# EasyEDA Pro project Solkatstice_v1.1_2025-04-18.epro, board Solkatstice
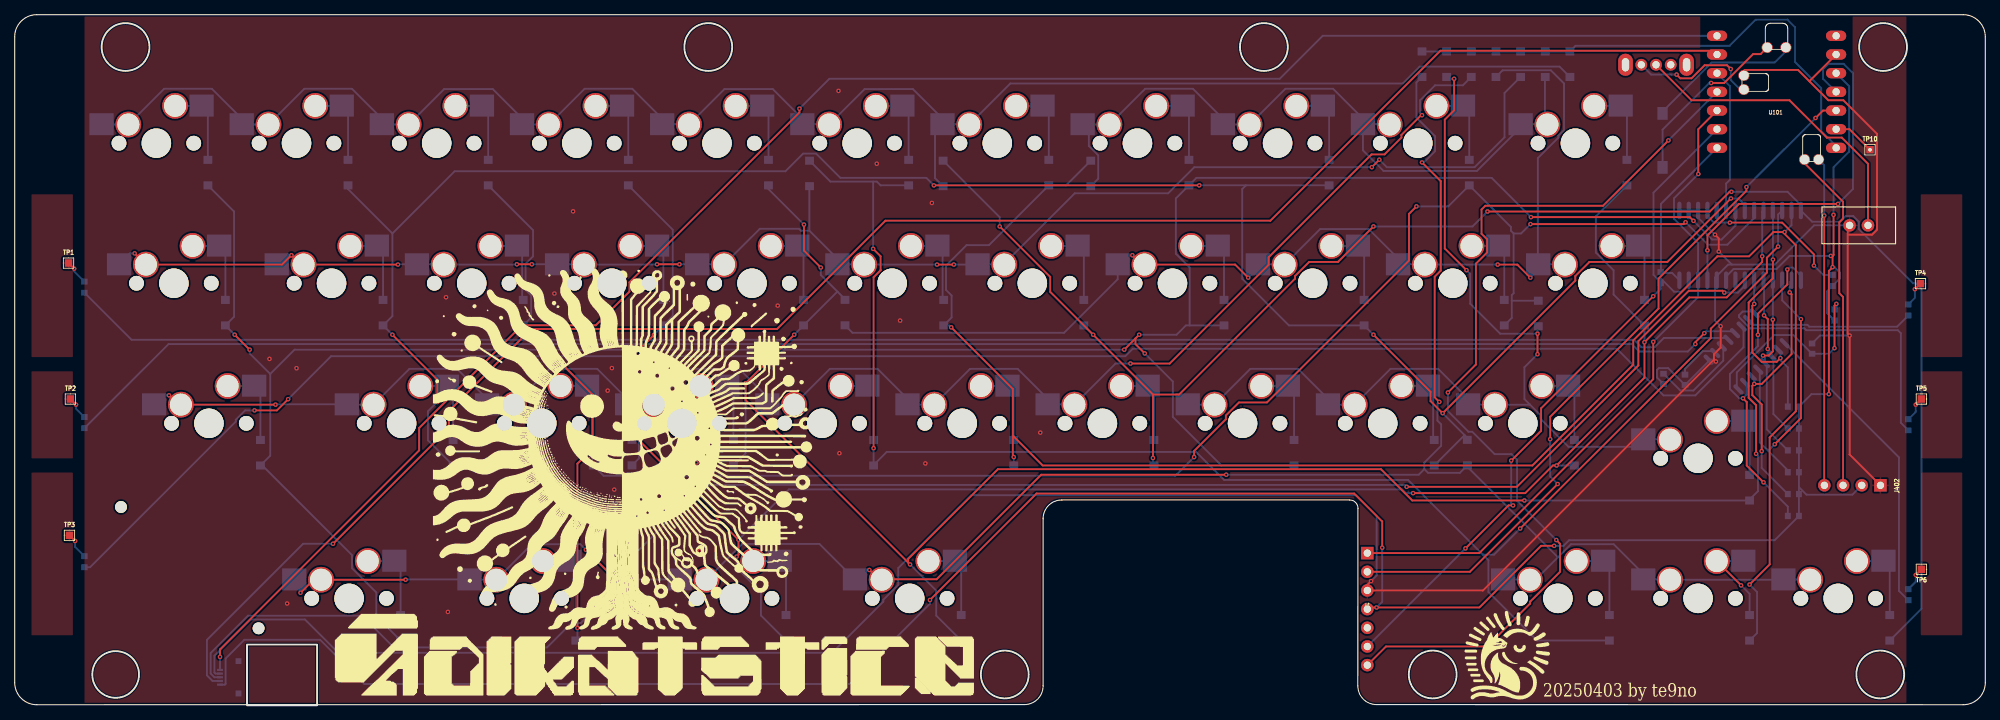
[diagram p2: board, top side]
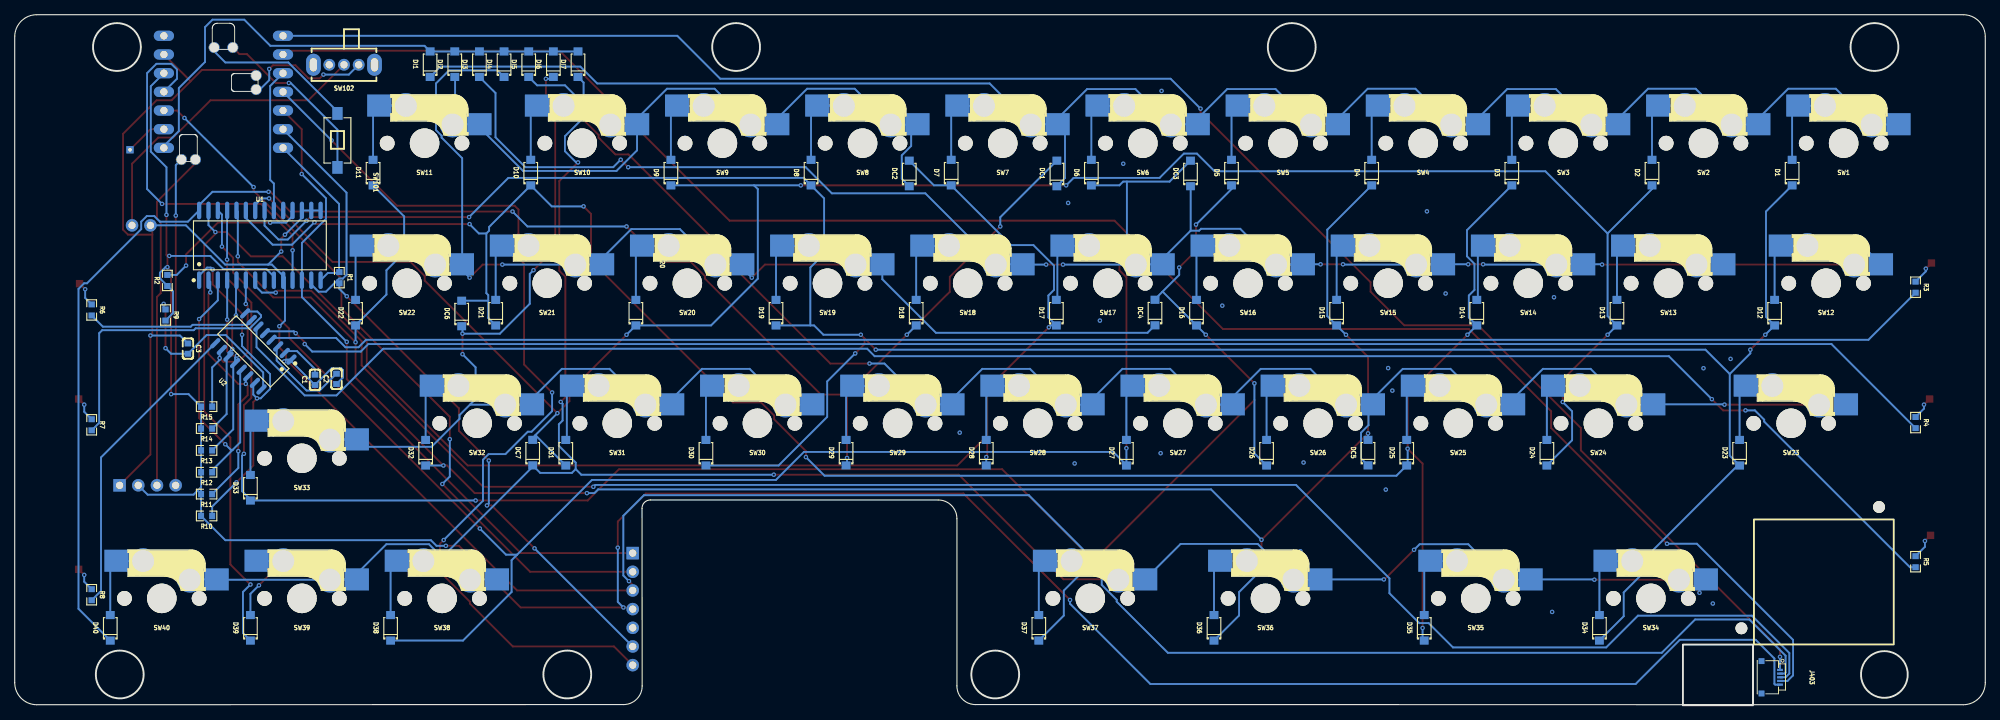
[diagram p3: board, bottom side, seen from below]

Outline 267.84 x 93.93 mm; copper layers: Top Layer, Bottom Layer. Coordinates in mm from the lower left corner of the outline.
Outline path: circle c13.72,4.19 r3.17 ; circle c15.06,89.53 r3.25 ; rectangle 31.57,8.25 41.1,0 ; circle c94.27,89.53 r3.25 ; circle c134.57,4.19 r3.25 ; circle c169.79,89.53 r3.25 ; circle c192.74,4.19 r3.25 ; circle c253.57,4.19 r3.25 ; circle c253.95,89.53 r3.25 ; 0,90.93 arc(0.88,93.05) 3,93.93 264.84,93.93 arc(266.96,93.05) 267.84,90.93 267.84,3.08 arc(266.96,0.96) 264.84,0.08 185.1,0.1 arc(183.3,0.84) 182.56,2.64 182.58,26.77 arc(182.26,27.58) 181.46,27.93 142.32,27.93 arc(140.52,27.18) 139.78,25.39 139.78,2.64 arc(139.04,0.84) 137.24,0.1 3,0.08 arc(0.88,0.96) 0,3.08 0,90.93
Stack: Top Layer 0.035mm / Dielectric1 1.51mm FR4 er 4.5 / Bottom Layer 0.035mm

## Design rules (mm)
template: User Custom Config
spacing safeClearance (default): track to track 0.203, other pairs 0.152 to 0.3
track width trackWidth (default): min 0.127, default 0.254, max 2.54
differential pair differentialPair (default): width min 0.127, default 0.254, max 2.54; gap min 0.152, default 0.152
via viaSize (default): diameter min 0.5, default 0.61, max 10; hole min 0.3, default 0.305, max 5.999
pour ie1338 uses CopperRegion3
pour ie1339 uses CopperRegion5

## Placement (name value [footprint] x y rotation side)
BT1  Battery_Cell  [kbd_Parts:Battery_2pin]  250.65 65.28 180 top
C1  4.7n  [C0603]  227.03 44.27 90 bottom
C2  5p  [C0603]  224.11 44.4 90 bottom
C3  100n  [C0603]  244.3 48.51 270 bottom
D1  D  [SOD-123_L2.7-W1.6-LS3.8-RD]  26.25 72.45 90 bottom
D2  D  [SOD-123_L2.7-W1.6-LS3.8-RD]  45.3 72.45 90 bottom
D3  D  [SOD-123_L2.7-W1.6-LS3.8-RD]  64.35 72.45 90 bottom
D4  D  [SOD-123_L2.7-W1.6-LS3.8-RD]  83.4 72.45 90 bottom
D5  D  [SOD-123_L2.7-W1.6-LS3.8-RD]  102.45 72.45 90 bottom
D6  D  [SOD-123_L2.7-W1.6-LS3.8-RD]  121.5 72.45 90 bottom
D7  D  [SOD-123_L2.7-W1.6-LS3.8-RD]  140.55 72.45 90 bottom
D8  D  [SOD-123_L2.7-W1.6-LS3.8-RD]  159.6 72.45 90 bottom
D9  D  [SOD-123_L2.7-W1.6-LS3.8-RD]  178.65 72.45 90 bottom
D10  D  [SOD-123_L2.7-W1.6-LS3.8-RD]  197.7 72.45 90 bottom
D11  D  [SOD-123_L2.7-W1.6-LS3.8-RD]  219.14 72.45 90 bottom
D12  D  [SOD-123_L2.7-W1.6-LS3.8-RD]  28.63 53.4 90 bottom
D13  D  [SOD-123_L2.7-W1.6-LS3.8-RD]  50.07 53.4 90 bottom
D14  D  [SOD-123_L2.7-W1.6-LS3.8-RD]  69.12 53.4 90 bottom
D15  D  [SOD-123_L2.7-W1.6-LS3.8-RD]  88.17 53.4 90 bottom
D16  D  [SOD-123_L2.7-W1.6-LS3.8-RD]  107.22 53.4 90 bottom
D17  D  [SOD-123_L2.7-W1.6-LS3.8-RD]  126.27 53.4 90 bottom
D18  D  [SOD-123_L2.7-W1.6-LS3.8-RD]  145.32 53.4 90 bottom
D19  D  [SOD-123_L2.7-W1.6-LS3.8-RD]  164.37 53.4 90 bottom
D20  D  [SOD-123_L2.7-W1.6-LS3.8-RD]  183.42 53.4 90 bottom
D21  D  [SOD-123_L2.7-W1.6-LS3.8-RD]  202.47 53.4 90 bottom
D22  D  [SOD-123_L2.7-W1.6-LS3.8-RD]  221.52 53.4 90 bottom
D23  D  [SOD-123_L2.7-W1.6-LS3.8-RD]  33.4 34.35 90 bottom
D24  D  [SOD-123_L2.7-W1.6-LS3.8-RD]  59.59 34.35 90 bottom
D25  D  [SOD-123_L2.7-W1.6-LS3.8-RD]  78.64 34.35 90 bottom
D26  D  [SOD-123_L2.7-W1.6-LS3.8-RD]  97.69 34.35 90 bottom
D27  D  [SOD-123_L2.7-W1.6-LS3.8-RD]  116.74 34.35 90 bottom
D28  D  [SOD-123_L2.7-W1.6-LS3.8-RD]  135.79 34.35 90 bottom
D29  D  [SOD-123_L2.7-W1.6-LS3.8-RD]  154.84 34.35 90 bottom
D30  D  [SOD-123_L2.7-W1.6-LS3.8-RD]  173.89 34.35 90 bottom
D31  D  [SOD-123_L2.7-W1.6-LS3.8-RD]  192.94 34.35 90 bottom
D32  D  [SOD-123_L2.7-W1.6-LS3.8-RD]  211.99 34.35 90 bottom
D33  D  [SOD-123_L2.7-W1.6-LS3.8-RD]  235.8 29.59 90 bottom
D34  D  [SOD-123_L2.7-W1.6-LS3.8-RD]  52.45 10.54 90 bottom
D35  D  [SOD-123_L2.7-W1.6-LS3.8-RD]  76.26 10.54 90 bottom
D36  D  [SOD-123_L2.7-W1.6-LS3.8-RD]  104.84 10.54 90 bottom
D37  D  [SOD-123_L2.7-W1.6-LS3.8-RD]  128.65 10.54 90 bottom
D38  D  [SOD-123_L2.7-W1.6-LS3.8-RD]  216.75 10.54 90 bottom
D39  D  [SOD-123_L2.7-W1.6-LS3.8-RD]  235.8 10.54 90 bottom
D40  D  [SOD-123_L2.7-W1.6-LS3.8-RD]  254.85 10.54 90 bottom
DC1  D  [SOD-123_L2.7-W1.6-LS3.8-RD]  126.19 72.34 90 bottom
DC2  D  [SOD-123_L2.7-W1.6-LS3.8-RD]  146.26 72.34 90 bottom
DC3  D  [SOD-123_L2.7-W1.6-LS3.8-RD]  108.03 72.34 90 bottom
DC4  D  [SOD-123_L2.7-W1.6-LS3.8-RD]  112.86 53.42 90 bottom
DC5  D  [SOD-123_L2.7-W1.6-LS3.8-RD]  83.9 34.37 90 bottom
DC6  D  [SOD-123_L2.7-W1.6-LS3.8-RD]  207.09 53.29 90 bottom
DC7  D  [SOD-123_L2.7-W1.6-LS3.8-RD]  197.44 34.37 90 bottom
DI1  D  [SOD-123_L2.7-W1.6-LS3.8-RD]  211.38 87.2 90 bottom
DI2  D  [SOD-123_L2.7-W1.6-LS3.8-RD]  208.03 87.2 90 bottom
DI3  D  [SOD-123_L2.7-W1.6-LS3.8-RD]  204.68 87.2 90 bottom
DI4  D  [SOD-123_L2.7-W1.6-LS3.8-RD]  201.33 87.2 90 bottom
DI5  D  [SOD-123_L2.7-W1.6-LS3.8-RD]  197.98 87.2 90 bottom
DI6  D  [SOD-123_L2.7-W1.6-LS3.8-RD]  194.63 87.2 90 bottom
DI7  D  [SOD-123_L2.7-W1.6-LS3.8-RD]  191.28 87.2 90 bottom
J1  ~  [roBa:pmw3610_connector]  183.85 13.08 0 top
J402  Conn_01x08  [display:OLED-128x32]  243.79 28.32 90 top
J403  Conn_01x08  [CONN-SMD_5P-P0.50_AFH34-S05FIA-1H]  29.16 3.81 270 bottom
R1  10K  [R0603]  223.72 58.17 270 bottom
R2  10K  [R0603]  247.09 57.78 90 bottom
R3  10K  [R0603]  9.48 56.87 270 bottom
R4  10K  [R0603]  9.48 38.45 270 bottom
R5  10K  [R0603]  9.48 19.53 270 bottom
R6  10K  [R0603]  257.38 53.78 270 bottom
R7  10K  [R0603]  257.38 38.15 270 bottom
R8  10K  [R0603]  257.38 15.04 270 bottom
R9  20  [R0603]  247.35 53.09 270 bottom
R10  10K  [R0603]  241.76 25.75 0 bottom
R11  10K  [R0603]  241.76 28.73 0 bottom
R12  10K  [R0603]  241.76 31.7 0 bottom
R13  10K  [R0603]  241.76 34.67 0 bottom
R14  10K  [R0603]  241.76 37.65 0 bottom
R15  10K  [R0603]  241.76 40.62 0 bottom
SW1  SW_PUSH  [kbd_SW:CherryMX_Hotswap_1u]  19.25 76.45 180 bottom
SW2  SW_PUSH  [kbd_SW:CherryMX_Hotswap_1u]  38.3 76.45 180 bottom
SW3  SW_PUSH  [kbd_SW:CherryMX_Hotswap_1u]  57.35 76.45 180 bottom
SW4  SW_PUSH  [kbd_SW:CherryMX_Hotswap_1u]  76.4 76.45 180 bottom
SW5  SW_PUSH  [kbd_SW:CherryMX_Hotswap_1u]  95.45 76.45 180 bottom
SW6  SW_PUSH  [kbd_SW:CherryMX_Hotswap_1u]  114.5 76.45 180 bottom
SW7  SW_PUSH  [kbd_SW:CherryMX_Hotswap_1u]  133.55 76.45 180 bottom
SW8  SW_PUSH  [kbd_SW:CherryMX_Hotswap_1u]  152.6 76.45 180 bottom
SW9  SW_PUSH  [kbd_SW:CherryMX_Hotswap_1u]  171.65 76.45 180 bottom
SW10  SW_PUSH  [kbd_SW:CherryMX_Hotswap_1u]  190.7 76.45 180 bottom
SW11  SW_PUSH  [kbd_SW:CherryMX_Hotswap_1u]  212.14 76.45 180 bottom
SW12  SW_PUSH  [kbd_SW:CherryMX_Hotswap_1u]  21.63 57.4 180 bottom
SW13  SW_PUSH  [kbd_SW:CherryMX_Hotswap_1u]  43.07 57.4 180 bottom
SW14  SW_PUSH  [kbd_SW:CherryMX_Hotswap_1u]  62.12 57.4 180 bottom
SW15  SW_PUSH  [kbd_SW:CherryMX_Hotswap_1u]  81.17 57.4 180 bottom
SW16  SW_PUSH  [kbd_SW:CherryMX_Hotswap_1u]  100.22 57.4 180 bottom
SW17  SW_PUSH  [kbd_SW:CherryMX_Hotswap_1u]  119.27 57.4 180 bottom
SW18  SW_PUSH  [kbd_SW:CherryMX_Hotswap_1u]  138.32 57.4 180 bottom
SW19  SW_PUSH  [kbd_SW:CherryMX_Hotswap_1u]  157.37 57.4 180 bottom
SW20  SW_PUSH  [kbd_SW:CherryMX_Hotswap_1u]  176.42 57.4 180 bottom
SW21  SW_PUSH  [kbd_SW:CherryMX_Hotswap_1u]  195.47 57.4 180 bottom
SW22  SW_PUSH  [kbd_SW:CherryMX_Hotswap_1u]  214.52 57.4 180 bottom
SW23  SW_PUSH  [kbd_SW:CherryMX_Hotswap_1u]  26.4 38.35 180 bottom
SW24  SW_PUSH  [kbd_SW:CherryMX_Hotswap_1u]  52.59 38.35 180 bottom
SW25  SW_PUSH  [kbd_SW:CherryMX_Hotswap_1u]  71.64 38.35 180 bottom
SW26  SW_PUSH  [kbd_SW:CherryMX_Hotswap_1u]  90.69 38.35 180 bottom
SW27  SW_PUSH  [kbd_SW:CherryMX_Hotswap_1u]  109.74 38.35 180 bottom
SW28  SW_PUSH  [kbd_SW:CherryMX_Hotswap_1u]  128.79 38.35 180 bottom
SW29  SW_PUSH  [kbd_SW:CherryMX_Hotswap_1u]  147.84 38.35 180 bottom
SW30  SW_PUSH  [kbd_SW:CherryMX_Hotswap_1u]  166.89 38.35 180 bottom
SW31  SW_PUSH  [kbd_SW:CherryMX_Hotswap_1u]  185.94 38.35 180 bottom
SW32  SW_PUSH  [kbd_SW:CherryMX_Hotswap_1u]  204.99 38.35 180 bottom
SW33  SW_PUSH  [kbd_SW:CherryMX_Hotswap_1u]  228.8 33.59 180 bottom
SW34  SW_PUSH  [kbd_SW:CherryMX_Hotswap_1u]  45.45 14.54 180 bottom
SW35  SW_PUSH  [kbd_SW:CherryMX_Hotswap_1u]  69.26 14.54 180 bottom
SW36  SW_PUSH  [kbd_SW:CherryMX_Hotswap_1u]  97.84 14.54 180 bottom
SW37  SW_PUSH  [kbd_SW:CherryMX_Hotswap_1u]  121.65 14.54 180 bottom
SW38  SW_PUSH  [kbd_SW:CherryMX_Hotswap_1u]  209.75 14.54 180 bottom
SW39  SW_PUSH  [kbd_SW:CherryMX_Hotswap_1u]  228.8 14.54 180 bottom
SW40  SW_PUSH  [kbd_SW:CherryMX_Hotswap_1u]  247.85 14.54 180 bottom
SW101  TSB008A2530A  [SW-SMD_L6.0-W3.5-LS8.0]  223.98 76.84 90 bottom
SW102  SK12D07VG5  [SW-TH_SK12D07VG5]  223.09 87.12 0 bottom
TP1  TestPoint  [TestPoint:TestPoint_Pad_1.0x1.0mm]  7.32 60.15 0 top
TP2  TestPoint  [TestPoint:TestPoint_Pad_1.0x1.0mm]  7.57 41.66 0 top
TP3  TestPoint  [TestPoint:TestPoint_Pad_1.0x1.0mm]  7.44 23.11 0 top
TP4  TestPoint  [TestPoint:TestPoint_Pad_1.0x1.0mm]  259.03 57.35 0 top
TP5  TestPoint  [TestPoint:TestPoint_Pad_1.0x1.0mm]  259.16 41.66 0 top
TP6  TestPoint  [TestPoint:TestPoint_Pad_1.0x1.0mm]  259.16 18.49 180 top
TP10  TestPoint  [TestPoint:TestPoint_THTPad_1.0x1.0mm_Drill0.5mm]  252.17 75.56 0 top
U1  xiao-ble  [SOIC-28_L17.9-W7.5-P1.27-LS10.3-BL]  234.52 62.56 180 bottom
U2  XW06A  [SOP-16_L10.0-W3.9-P1.27-LS6.0-BL]  235.41 48.13 45 bottom
U101  xiao-ble  [mcu:xiao-ble-tht]  239.47 83.44 0 top
U102  -  [Joystick]  31.45 25.27 270 top

## Footprints (pads in the part's own frame, mm; a bottom-side part is the same pattern mirrored in y, then rotated)
C0603
  rect 0.8x0.9 smd: 1(-0.7,0) 2(0.7,0)
CONN-SMD_5P-P0.50_AFH34-S05FIA-1H
  rect 0.3x0.8 smd: 1(-1,1.254) 2(-0.5,1.256) 3(0,1.256) 4(0.5,1.256) 5(1,1.256)
  rect 0.8x0.8 smd: 6(2.2,-1.256) 7(-2.2,-1.256)
display:OLED-128x32
  round 1.7 hole 1: 1(1.6,-2.18) 2(1.6,-4.72) 3(1.6,-7.26)
  rect 1.7x1.7 hole 1: 4(1.6,-9.8)
Joystick
  round 1.6 hole 1.6: 1(-1.7,-17) 1(14.8,1.7)
kbd_Parts:Battery_2pin
  round 1.7 hole 1: 1(-1.25,0) 2(1.25,0)
kbd_SW:CherryMX_Hotswap_1u
  round 2 hole 2: (-5.08,0) (5.08,0)
  round 4 hole 4: (0,0)
  round 3.5 hole 3: 1(3.81,2.54) 2(-2.54,5.08)
  rect 3.3x3 smd: 1(7.45,2.58) 2(-6.15,5.12)
mcu:xiao-ble-tht
  oval 2.75x1.4 hole 1: 1(-8.095,7.62) 2(-8.095,5.08) 3(-8.095,2.54) 4(-8.095,0) 5(-8.095,-2.54) 6(-8.095,-5.08) 7(-8.095,-7.62) 8(8.095,-7.62) 9(8.095,-5.08) 10(8.095,-2.54) 11(8.095,0) 12(8.095,2.54) 13(8.095,5.08) 14(8.095,7.62)
  round 1.5 hole 1.3: 17(-1.271,6.031) 18(1.269,6.031) 19(-4.446,0.316) 20(-4.446,2.221) 21(3.809,-9.209) 22(5.714,-9.209)
R0603
  rect 0.806x0.864 smd: 1(-0.753,0) 2(0.753,0)
roBa:pmw3610_connector
  rect 1.7x1.7 hole 1: 1(0,7.62)
  round 1.7 hole 1: 2(0,5.08) 3(0,2.54) 4(0,0) 5(0,-2.54) 6(0,-5.08) 7(0,-7.62)
SOD-123_L2.7-W1.6-LS3.8-RD
  rect 1.1x1.2 smd: 1(-1.735,0) 2(1.735,0)
SOIC-28_L17.9-W7.5-P1.27-LS10.3-BL
  oval 0.574x2.388 smd: 1(-8.255,-4.744) 2(-6.985,-4.744) 3(-5.715,-4.744) 4(-4.445,-4.744) 5(-3.175,-4.744) 6(-1.905,-4.744) 7(-0.635,-4.744) 8(0.635,-4.744) 9(1.905,-4.744) 10(3.175,-4.744) 11(4.445,-4.744) 12(5.715,-4.744) 13(6.985,-4.744) 14(8.255,-4.744) 15(8.255,4.744) 16(6.985,4.744) 17(5.715,4.744) 18(4.445,4.744) 19(3.175,4.744) 20(1.905,4.744) 21(0.635,4.744) 22(-0.635,4.744) 23(-1.905,4.744) 24(-3.175,4.744) 25(-4.445,4.744) 26(-5.715,4.744) 27(-6.985,4.744) 28(-8.255,4.744)
SOP-16_L10.0-W3.9-P1.27-LS6.0-BL
  oval 0.56x1.745 smd: 1(-4.445,-2.873) 2(-3.175,-2.873) 3(-1.905,-2.873) 4(-0.635,-2.873) 5(0.635,-2.873) 6(1.905,-2.873) 7(3.175,-2.873) 8(4.445,-2.873) 9(4.445,2.873) 10(3.175,2.873) 11(1.905,2.873) 12(0.635,2.873) 13(-0.635,2.873) 14(-1.905,2.873) 15(-3.175,2.873) 16(-4.445,2.873)
SW-SMD_L6.0-W3.5-LS8.0
  rect 1.74x1.4 smd: 1(-3.67,0) 2(3.67,0)
SW-TH_SK12D07VG5
  oval 1.6x1.6 hole 1: 1(-2,0) 2(0,0) 3(2,0)
  oval 2x3 hole 1x1.8: 4(4.15,0) 5(-4.15,0)
TestPoint:TestPoint_Pad_1.0x1.0mm
  rect 1x1 smd: 1(0,0)
TestPoint:TestPoint_THTPad_1.0x1.0mm_Drill0.5mm
  rect 1x1 hole 0.5: 1(0,0)

## Nets
3.3V: J1.4 J402.3 J403.5 R2.1 R9.2 R10.2 R11.2 R12.2 R13.2 R14.2 R15.2 U1.9 U101.12
GND: BT1.2 C1.1 C2.1 C3.1 J1.3 J402.4 J403.2 U1.10 U1.15 U1.16 U1.17 U2.1 U101.13 U101.20
BAT+: SW102.1 U101.19
CS1: U1.11 U101.11
CS2: J1.2 U101.10
INT: DI1.2 DI2.2 DI3.2 DI4.2 DI5.2 DI6.2 DI7.2 U101.8
INTA: U1.20 U101.3
MISO: R1.1 U1.14 U101.7
MOSI: J1.6 R1.2 U1.13 U101.6
MOT: J1.7 U101.4
NET-(BT1-+): BT1.1 SW102.2
NET-(D1-A): D1.2 SW1.2
NET-(D2-A): D2.2 SW2.2
NET-(D3-A): D3.2 SW3.2
NET-(D4-A): D4.2 SW4.2
NET-(D5-A): D5.2 SW5.2
NET-(D6-A): D6.2 SW6.2
NET-(D7-A): D7.2 SW7.2
NET-(D8-A): D8.2 SW8.2
NET-(D9-A): D9.2 SW9.2
NET-(D10-A): D10.2 SW10.2
NET-(D11-A): D11.2 SW11.2
NET-(D12-A): D12.2 SW12.2
NET-(D13-A): D13.2 SW13.2
NET-(D14-A): D14.2 SW14.2
NET-(D15-A): D15.2 SW15.2
NET-(D16-A): D16.2 SW16.2
NET-(D17-A): D17.2 SW17.2
NET-(D18-A): D18.2 SW18.2
NET-(D19-A): D19.2 SW19.2
NET-(D20-A): D20.2 SW20.2
NET-(D21-A): D21.2 SW21.2
NET-(D22-A): D22.2 SW22.2
NET-(D23-A): D23.2 SW23.2
NET-(D24-A): D24.2 SW24.2
NET-(D25-A): D25.2 SW25.2
NET-(D26-A): D26.2 SW26.2
NET-(D27-A): D27.2 SW27.2
NET-(D28-A): D28.2 SW28.2
NET-(D29-A): D29.2 SW29.2
NET-(D30-A): D30.2 SW30.2
NET-(D31-A): D31.2 SW31.2
NET-(D32-A): D32.2 SW32.2
NET-(D33-A): D33.2 SW33.2
NET-(D34-A): D34.2 SW34.2
NET-(D35-A): D35.2 SW35.2
NET-(D36-A): D36.2 SW36.2
NET-(D37-A): D37.2 SW37.2
NET-(D38-A): D38.2 SW38.2
NET-(D39-A): D39.2 SW39.2
NET-(D40-A): D40.2 SW40.2
NET-(DC1-K): DC1.1 DI1.1 SW1.1 SW2.1 SW3.1 SW4.1 SW5.1 SW6.1 SW7.1
NET-(DC2-K): DC2.1 DI2.1 SW8.1 SW9.1 SW10.1 SW11.1
NET-(DC3-K): DC3.1 DI3.1 SW12.1 SW13.1 SW14.1 SW15.1 SW16.1 SW17.1 SW18.1
NET-(DC4-K): DC4.1 DI4.1 SW19.1 SW20.1 SW21.1 SW22.1
NET-(DC5-K): DC5.1 DI5.1 SW23.1 SW24.1 SW25.1 SW26.1 SW27.1 SW28.1 SW29.1
NET-(DC6-K): DC6.1 DI6.1 SW30.1 SW31.1 SW32.1 SW33.1
NET-(DC7-K): DC7.1 DI7.1 SW34.1 SW35.1 SW36.1 SW37.1 SW38.1 SW39.1 SW40.1
NET-(R3-PAD1): R3.1 TP1.1
NET-(R3-PAD2): R3.2 U2.4
NET-(R4-PAD1): R4.1 TP2.1
NET-(R4-PAD2): R4.2 U2.5
NET-(R5-PAD1): R5.1 TP3.1
NET-(R5-PAD2): R5.2 U2.6
NET-(R6-PAD1): R6.1 TP4.1
NET-(R6-PAD2): R6.2 U2.7
NET-(R7-PAD1): R7.1 TP5.1
NET-(R7-PAD2): R7.2 U2.8
NET-(R8-PAD1): R8.1 TP6.1
NET-(R8-PAD2): R8.2 U2.9
NET-(SW101-PAD2): SW101.2 U101.18
NET-(U1-~{RESET}): R2.2 U1.18
NET-(U2-C1): C1.2 U2.2
NET-(U2-CSEL): C2.2 U2.3
NET-(U2-VDD): C3.2 R9.1 U2.16
NET-(U101-A7_SCK{SLASH}1.13): TP10.1 U101.9
NET-(U101-RESET): SW101.1 U101.17
S0: D1.1 D8.1 D12.1 D19.1 D23.1 D30.1 D34.1 U1.21
S1: D2.1 D9.1 D13.1 D20.1 D24.1 D31.1 DC7.2 U1.22
S2: D3.1 D10.1 D14.1 D21.1 D25.1 D35.1 DC6.2 U1.23
S3: D4.1 D11.1 D15.1 D22.1 D32.1 D36.1 DC5.2 U1.24
S4: D5.1 D16.1 D26.1 D33.1 D37.1 DC4.2 U1.25
S5: D6.1 D27.1 D38.1 DC3.2 U1.26
S6: D7.1 D17.1 D28.1 D39.1 DC2.2 U1.27
S7: D18.1 D29.1 D40.1 DC1.2 U1.28
S8: R10.1 U1.1 U2.15
S9: R11.1 U1.2 U2.14
S10: R12.1 U1.3 U2.13
S11: R13.1 U1.4 U2.12
S12: R14.1 U1.5 U2.11
S13: R15.1 U1.6 U2.10
S14: J403.3 U1.7
SCK: J1.1 U1.12 U101.5
SCL: J402.2 U101.21
SDA: J402.1 U101.22
UNCONNECTED-(J1-NC-PAD5): J1.5
UNCONNECTED-(SW102-C-PAD3): SW102.3
UNCONNECTED-(U1-GPB7-PAD8): U1.8
UNCONNECTED-(U1-INTB-PAD19): U1.19
UNCONNECTED-(U101-5V-PAD14): U101.14
X: J403.4 U101.2
Y: J403.1 U101.1

Pads without a net: J403 6 7; SW102 4 5; U102 1

## Via types
v1: diameter 0.61, hole 0.305, Top Layer to Bottom Layer, 170 vias

## Routing (per net, layer and track width the routed paths; a pad name or vN(x,y) marks a point on that pad's centre or on a via; arc(x,y) is an arc through that point)
3.3V: length 353.3
  Top Layer w0.254: 247.09,61.12 v1(246.84,61.12) ; 247.09,61.12 v1(247.09,59.6) 246.58,59.09 v1(246.58,42.32) ; 247.09,61.12 247.22,61.25 v1(247.22,66.71) ; J1.4 184.07,13.31 v1(185.11,13.31) 199.08,13.31 207.46,21.69 v1(209.24,21.69) ; v1(124.4,14.32) 138.88,28.8 182.06,28.8 185.87,24.99 v1(185.87,21.44)
  Bottom Layer w0.254: 251.05,29.92 249.78,28.65 243.53,28.65 242.51,29.67 ; R9.2 246.33,53.35 246.33,56.29 247.09,57.06 ; 242.51,29.67 R12.2 R13.2 R14.2 R15.2 244.22,42.32 v1(246.58,42.32) ; 242.51,29.67 R11.2 R10.2 239.21,22.45 211.27,22.45 210.51,21.69 v1(209.24,21.69) ; v1(247.09,59.6) 247.35,59.6 248.11,58.83 248.11,58.07 247.09,57.06 ; U1.9 232.61,58.33 233.63,59.34 239.47,59.34 241.25,61.12 v1(246.84,61.12) ; 247.09,57.06 R2.1 ; v1(247.22,66.71) 247.22,73.19 249.34,75.31 249.34,84.2 247.57,85.98 ; v1(185.11,13.31) 185.87,14.07 v1(185.87,21.44) ; v1(124.4,14.32) 124.4,13.82 113.48,2.89 47.53,2.89 41.52,8.91 31.21,8.91 28.67,6.37 28.67,2.92 28.56,2.81 J403.5
GND: length 393.8
  Top Layer w0.254: 249.14,64.01 252.45,64.01 253.12,64.68 253.12,77.72 248.55,82.3 246.52,82.3 243.98,84.84 ; 249.14,64.01 249.14,65.02 BT1.2 ; 249.14,64.01 249.14,50.55 v1(249.4,50.29) 249.4,34.11 253.59,29.92 ; U101.20 234.9,85.79 234.9,86.17 235.15,86.42 242.39,86.42 243.98,84.84 ; 243.98,84.84 243.98,84.93 U101.13 ; 230.96,47.02 230.96,47.75 231.87,48.66 v1(231.87,51.56) ; 230.96,47.02 199.56,15.62 183.85,15.62 183.85,16.38 v1(184.35,16.89) ; 230.96,47.02 v1(231.22,46.77) ; v1(231.62,61.72) 231.62,63.5 v1(231.11,64.01)
  Bottom Layer w0.254: v1(231.11,64.01) 228.81,66.31 U1.17 U1.16 U1.15 ; v1(184.35,16.89) 185.12,17.65 185.12,25.78 182.32,28.58 130,28.58 120.09,18.67 120.09,16.38 118.06,14.35 118.06,14.1 111.1,7.14 43.98,7.14 39.44,11.68 32.07,11.68 27.14,6.75 27.14,4.46 27.29,4.31 J403.2 ; v1(231.87,51.56) 231.11,52.32 231.11,58.17 ; BT1.2 244.57,65.28 239.24,59.94 233.4,59.94 ; C3.1 245.38,50.29 v1(249.4,50.29) ; 231.11,58.17 U1.10 ; 231.11,58.17 232.89,59.94 233.4,59.94 ; 233.4,59.94 v1(231.62,61.72) ; C2.1 223.22,44.59 223.22,45.61 223.47,45.86 224.74,45.86 C1.1 230.23,46.78 U2.1 230.96,47.02 v1(231.22,46.77)
  vias: v1(34.62,47.12) v1(37.03,13.84) v1(38.3,45.85) v1(58.62,55.5) v1(58.88,12.7) v1(73.36,56.01) v1(75.9,67.18) v1(80.59,42.8) v1(81.17,45.86) v1(81.48,29.34) v1(92.66,33.02) v1(93.09,20.96) v1(103.71,54.36) v1(111.96,83.57) v1(112.09,34.29) v1(117.17,73.66) v1(120.35,52.32) v1(123.77,32.89) v1(124.66,68.33) v1(139.4,37.08)
BAT+: length 17.8
  Top Layer w0.254: v1(233.25,86.55) 232.74,87.06 229.69,87.06 227.91,85.28 226.39,85.28 v1(225.88,85.79)
  Bottom Layer w0.254: 235.03,83.75 234.9,83.63 234.64,83.63 233.25,85.03 v1(233.25,86.55) ; v1(225.88,85.79) 222.42,85.79 SW102.1
CS1: length 52.9
  Top Layer w0.254: v1(247.82,68.2) 234.36,68.2 230.08,63.91 v1(230.08,61.88)
  Bottom Layer w0.254: v1(230.08,61.88) U1.11 ; v1(247.82,68.2) 249.85,70.23 249.85,85.98 248.58,87.25 246.55,87.25 245.79,86.49 245.79,85.22 U101.11
CS2: length 99.2
  Top Layer w0.254: J1.2 197.78,18.16 v1(209.72,30.1) ; v1(235.37,70.48) 235.37,69.98 223.44,58.04 223.44,53.98 208.7,39.24 v1(208.7,36.2) ; U101.10 245.79,80.9 v1(244.77,79.88)
  Bottom Layer w0.254: v1(244.77,79.88) v1(235.37,70.48) ; v1(208.7,36.2) 208.7,31.12 v1(209.72,30.1)
INT: length 71.6
  Bottom Layer w0.254: U101.8 247.57,76.07 245.53,78.11 245.53,83.95 241.98,87.5 241.98,92.24 240.96,93.25 236.64,93.25 233.09,89.7 212.14,89.7 DI1.2 DI2.2 DI3.2 DI4.2 DI5.2 DI6.2 DI7.2
INTA: length 19.6
  Bottom Layer w0.254: 231.38,85.98 233.12,84.23 233.12,71.47 232.62,70.96 U1.20
MISO: length 23.2
  Bottom Layer w0.254: 231.38,75.82 223.76,68.2 223.76,58.8 ; 223.76,58.8 R1.1 ; 223.76,58.8 225.28,58.8 U1.14
MOSI: length 97.1
  Top Layer w0.254: v1(203.4,33.28) 207.47,37.35 207.47,40.39 v1(222.71,55.63) ; v1(203.66,27.19) 203.03,27.19 v1(197.19,21.34)
  Bottom Layer w0.254: v1(203.66,27.19) 203.4,27.44 v1(203.4,33.28) ; v1(197.19,21.34) 183.85,8 ; 224.01,57.78 225.53,56.26 226.55,56.26 227.54,57.25 U1.13 ; 224.01,57.78 R1.2 223.72,56.65 v1(222.71,55.63) ; 224.01,57.78 223.76,58.04 223.25,58.04 222.74,58.55 222.74,69.72 231.38,78.36
MOT: length 130
  Top Layer w0.254: v1(194.8,42.55) 198.61,46.36 198.61,60.07 200.13,61.59 200.13,63.37 199.37,64.14 199.37,67.44 199.88,67.95 215.88,67.95 v1(224.77,76.84) ; 183.85,5.46 186.39,8 200.13,8 205.98,13.84 205.98,14.1 210.04,18.16 210.04,21.97 v1(209.53,22.48)
  Bottom Layer w0.254: v1(209.53,22.48) 204.2,27.81 204.2,33.4 203.44,34.16 201.15,34.16 198.1,37.21 197.59,37.21 194.8,40 v1(194.8,42.55) ; 231.38,83.44 v1(224.77,76.84)
NET-(BT1-+): length 42.8
  Top Layer w0.254: BT1.1 251.9,73.66 248.34,77.22 246.31,77.22 241.23,82.3 227.91,82.3 SW102.2
NET-(D1-A): length 11.3
  Bottom Layer w0.254: SW1.2 25.35,81.53 ; 25.35,81.53 26.25,80.63 D1.2 ; 25.35,81.53 SW1.2
NET-(D2-A): length 11.3
  Bottom Layer w0.254: 44.4,81.53 45.3,80.63 D2.2 ; 44.4,81.53 SW2.2 ; 44.4,81.53 SW2.2
NET-(D3-A): length 11.3
  Bottom Layer w0.254: D3.2 64.35,80.63 63.45,81.53 ; 63.45,81.53 SW3.2 ; 63.45,81.53 SW3.2
NET-(D4-A): length 11.4
  Bottom Layer w0.254: D4.2 83.4,80.72 SW4.2 82.51,81.53 SW4.2
NET-(D5-A): length 11.4
  Bottom Layer w0.254: D5.2 102.45,80.72 SW5.2 101.56,81.53 SW5.2
NET-(D6-A): length 11.4
  Bottom Layer w0.254: D6.2 121.5,80.72 SW6.2 120.61,81.53 SW6.2
NET-(D7-A): length 11.4
  Bottom Layer w0.254: D7.2 140.55,80.72 SW7.2 139.66,81.53 SW7.2
NET-(D8-A): length 11.4
  Bottom Layer w0.254: D8.2 159.6,80.72 SW8.2 158.71,81.53 SW8.2
NET-(D9-A): length 11.4
  Bottom Layer w0.254: D9.2 178.65,80.72 SW9.2 177.76,81.53 SW9.2
NET-(D10-A): length 11.4
  Bottom Layer w0.254: D10.2 197.7,80.72 SW10.2 196.81,81.53 SW10.2
NET-(D11-A): length 11.3
  Bottom Layer w0.254: SW11.2 218.23,81.53 ; 218.23,81.53 SW11.2 ; 218.23,81.53 219.13,80.63 219.13,74.19
NET-(D12-A): length 11.3
  Bottom Layer w0.254: SW12.2 27.73,62.48 ; 27.73,62.48 SW12.2 ; 27.73,62.48 28.63,61.58 28.63,55.14
NET-(D13-A): length 11.3
  Bottom Layer w0.254: SW13.2 49.16,62.48 ; 49.16,62.48 50.07,61.58 D13.2 ; 49.16,62.48 SW13.2
NET-(D14-A): length 11.3
  Bottom Layer w0.254: D14.2 68.97,55.28 68.97,61.72 68.21,62.48 ; SW14.2 68.21,62.48 ; 68.21,62.48 SW14.2
NET-(D15-A): length 11.3
  Bottom Layer w0.254: SW15.2 87.26,62.48 ; 87.26,62.48 SW15.2 ; 87.26,62.48 88.17,61.58 D15.2
NET-(D16-A): length 11.3
  Bottom Layer w0.254: SW16.2 106.31,62.48 ; 106.31,62.48 107.22,61.58 D16.2 ; 106.31,62.48 SW16.2
NET-(D17-A): length 11.3
  Bottom Layer w0.254: SW17.2 125.36,62.48 ; 125.36,62.48 126.12,61.72 126.12,55.28 D17.2 ; 125.36,62.48 125.38,62.48 SW17.2
NET-(D18-A): length 11.3
  Bottom Layer w0.254: 144.41,62.48 145.32,61.58 D18.2 ; 144.41,62.48 SW18.2 ; 144.41,62.48 144.43,62.48 SW18.2
NET-(D19-A): length 11.3
  Bottom Layer w0.254: D19.2 164.37,61.58 163.46,62.48 ; SW19.2 163.46,62.48 ; 163.46,62.48 163.48,62.48 SW19.2
NET-(D20-A): length 11.3
  Bottom Layer w0.254: SW20.2 182.53,62.48 182.51,62.48 ; 182.51,62.48 183.42,61.58 D20.2 ; 182.51,62.48 SW20.2
NET-(D21-A): length 11.3
  Bottom Layer w0.254: 201.56,62.48 SW21.2 ; 201.56,62.48 SW21.2 ; 201.56,62.48 202.47,61.58 D21.2
NET-(D22-A): length 11.3
  Bottom Layer w0.254: D22.2 221.52,61.58 220.61,62.48 ; 220.61,62.48 SW22.2 ; 220.61,62.48 SW22.2
NET-(D23-A): length 11.3
  Bottom Layer w0.254: D23.2 33.4,42.53 32.49,43.43 ; 32.49,43.43 SW23.2 ; 32.49,43.43 SW23.2
NET-(D24-A): length 11.3
  Bottom Layer w0.254: 58.69,43.43 59.59,42.53 D24.2 ; 58.69,43.43 SW24.2 ; 58.69,43.43 SW24.2
NET-(D25-A): length 11.3
  Bottom Layer w0.254: D25.2 78.64,42.53 77.74,43.43 ; SW25.2 77.74,43.43 ; 77.74,43.43 SW25.2
NET-(D26-A): length 11.3
  Bottom Layer w0.254: SW26.2 96.79,43.43 ; 96.79,43.43 SW26.2 ; 96.79,43.43 97.69,42.53 D26.2
NET-(D27-A): length 11.3
  Bottom Layer w0.254: D27.2 116.74,42.53 115.84,43.43 ; SW27.2 115.85,43.43 115.84,43.43 ; 115.84,43.43 SW27.2
NET-(D28-A): length 11.3
  Bottom Layer w0.254: SW28.2 134.9,43.43 134.89,43.43 ; 134.89,43.43 135.79,42.53 D28.2 ; 134.89,43.43 SW28.2
NET-(D29-A): length 11.3
  Bottom Layer w0.254: 153.94,43.43 153.95,43.43 SW29.2 ; 153.94,43.43 SW29.2 ; 153.94,43.43 154.84,42.53 D29.2
NET-(D30-A): length 11.3
  Bottom Layer w0.254: SW30.2 172.99,43.43 ; 172.99,43.43 173.89,42.53 D30.2 ; 172.99,43.43 173,43.43 SW30.2
NET-(D31-A): length 11.3
  Bottom Layer w0.254: 192.04,43.43 SW31.2 ; 192.04,43.43 SW31.2 ; 192.04,43.43 192.8,42.67 192.8,36.23 D31.2
NET-(D32-A): length 11.3
  Bottom Layer w0.254: SW32.2 211.09,43.43 ; 211.09,43.43 211.99,42.53 D32.2 ; 211.09,43.43 SW32.2
NET-(D33-A): length 11.4
  Bottom Layer w0.254: D33.2 235.8,37.86 SW33.2 234.91,38.67 SW33.2
NET-(D34-A): length 11.4
  Bottom Layer w0.254: SW34.2 51.56,19.62 SW34.2 52.45,18.81 D34.2
NET-(D35-A): length 11.3
  Bottom Layer w0.254: D35.2 76.26,18.72 75.36,19.62 ; 75.36,19.62 SW35.2 ; 75.36,19.62 SW35.2
NET-(D36-A): length 11.3
  Bottom Layer w0.254: 104.83,12.28 104.83,18.72 103.93,19.62 ; 103.93,19.62 SW36.2 ; 103.93,19.62 SW36.2
NET-(D37-A): length 11.4
  Bottom Layer w0.254: D37.2 128.65,18.81 SW37.2 127.76,19.62 SW37.2
NET-(D38-A): length 11.4
  Bottom Layer w0.254: D38.2 216.75,18.81 SW38.2 215.86,19.62 SW38.2
NET-(D39-A): length 12.8
  Top Layer w0.254: SW39.2 v1(234.65,16.32)
  Bottom Layer w0.254: D39.2 235.8,15.16 v1(234.65,16.32) ; SW39.2 234.91,19.62 SW39.2
NET-(D40-A): length 11.4
  Bottom Layer w0.254: D40.2 254.85,18.81 SW40.2 253.96,19.62 SW40.2
NET-(DC1-K): length 239.6
  Bottom Layer w0.254: SW7.1 126.1,79.8 122.08,83.82 115.52,83.82 SW6.1 110.65,79.03 SW6.1 107.05,79.8 103.03,83.82 96.47,83.82 SW5.1 91.6,79.03 SW5.1 88,79.8 83.94,83.86 77.46,83.86 SW4.1 69.04,78.99 ; SW7.1 125.09,78.02 125.09,71.71 DC1.1 ; SW7.1 129.7,79.03 SW7.1 135.33,84.58 188.67,84.58 190.96,86.87 209.98,86.87 DI1.1 ; 69.04,78.99 69.04,79.76 64.97,83.82 58.37,83.82 SW3.1 49.94,78.99 SW3.1 49.9,79.8 45.84,83.86 39.36,83.86 SW2.1 30.89,78.99 SW2.1 30.85,79.8 26.79,83.86 20.31,83.86 SW1.1 11.84,78.99 SW1.1 ; 69.04,78.99 SW4.1
NET-(DC2-K): length 99.3
  Bottom Layer w0.254: 146.25,78.99 146,78.74 146,76.07 147.27,74.8 147.27,71.62 DC2.1 ; 146.25,78.99 145.19,78.99 SW8.1 ; 146.25,78.99 SW8.1 153.66,83.86 160.14,83.86 164.2,79.8 SW9.1 164.24,78.99 SW9.1 172.71,83.86 179.19,83.86 183.25,79.8 SW10.1 ; 207.99,79.03 SW11.1 ; 207.99,79.03 207.99,85.42 DI2.1 ; 207.99,79.03 SW11.1 204.59,78.94 204.59,78.53 198.75,72.68 186.05,72.68 183.25,75.48 SW10.1 ; SW10.1 186.85,79.03 SW10.1
NET-(DC3-K): length 221
  Top Layer w0.254: v1(184.46,73.19) v1(185.48,74.21) ; v1(68.25,59.98) v1(70.28,59.98) ; v1(16.3,61.47) SW12.1 36.34,59.94 v1(37.61,61.21) 38.88,59.94 SW13.1 v1(52.09,59.94) ; v1(87.3,59.98) v1(90.35,59.98) ; v1(125.36,59.94) v1(127.65,59.94)
  Bottom Layer w0.254: v1(16.3,61.47) 15.67,61.47 SW12.1 ; SW13.1 36.85,61.21 v1(37.61,61.21) ; v1(127.65,59.94) 130.83,59.94 SW18.1 134.42,59.98 ; v1(52.09,59.94) 52.13,59.98 SW14.1 58.27,59.98 SW14.1 68.21,59.94 v1(68.25,59.98) ; 134.42,59.98 144.07,69.64 156.77,69.64 160.33,73.19 v1(184.46,73.19) ; 134.42,59.98 SW18.1 ; v1(185.48,74.21) 186.49,73.19 198.43,73.19 202.49,77.26 202.49,83.28 DI3.1 ; v1(125.36,59.94) SW17.1 115.42,59.98 SW17.1 111.82,60.75 108.01,64.56 ; v1(90.35,59.98) SW16.1 96.37,59.98 SW16.1 101.27,64.81 106.61,64.81 106.86,64.56 108.01,64.56 ; 108.01,64.56 108.01,70.58 DC3.1 ; v1(70.28,59.98) SW15.1 77.32,59.98 SW15.1 87.26,59.94 v1(87.3,59.98)
NET-(DC4-K): length 149.1
  Top Layer w0.254: v1(151.91,61.21) 153.18,59.94 SW19.1 165.88,59.94 v1(167.66,58.17) ; v1(201.56,59.94) 204.23,59.94 v1(206.01,58.17)
  Bottom Layer w0.254: SW22.1 210.67,59.98 SW22.1 207.03,59.94 ; DI4.1 202.23,86.36 208.8,86.36 210.58,84.58 210.58,78.23 209.82,77.47 209.82,77.22 207.03,74.42 207.03,59.94 ; 207.03,59.94 207.03,59.18 v1(206.01,58.17) ; v1(151.91,61.21) 151.15,61.21 SW19.1 149.92,57.95 142.63,50.67 113.87,50.67 DC4.1 ; v1(167.66,58.17) 168.97,59.48 SW20.1 172.57,59.98 SW20.1 177.43,64.77 184.04,64.77 188.02,60.79 SW21.1 191.62,59.98 SW21.1 v1(201.56,59.94)
NET-(DC5-K): length 232.5
  Top Layer w0.254: v1(191.28,80.26) 191.16,80.26 188.48,77.58 188.48,77.22 186.2,74.93 184.42,74.93 170.45,60.96 170.45,59.94 156.99,46.48 v1(151.65,46.48) ; v1(35.45,40.89) SW23.1 22.24,40.89 v1(20.97,42.16)
  Bottom Layer w0.254: v1(35.45,40.89) 35.49,40.93 SW24.1 45.18,40.89 SW24.1 53.65,45.76 60.13,45.76 64.19,41.7 SW25.1 64.23,40.89 SW25.1 72.7,45.76 79.18,45.76 83.24,41.7 SW26.1 83.28,40.89 83.83,40.89 ; v1(20.97,42.16) 20.18,42.16 SW23.1 ; DC5.1 84.85,33.58 84.85,37.08 83.83,38.1 83.83,40.89 ; v1(191.28,80.26) 191.02,80.52 191.02,82.3 193.05,84.33 196.84,84.33 DI5.1 ; 83.83,40.89 SW26.1 91.75,45.76 98.48,45.76 102.29,41.95 SW27.1 102.33,40.89 SW27.1 110.8,45.76 117.28,45.76 121.34,41.7 SW28.1 121.38,40.89 SW28.1 129.85,45.76 136.33,45.76 140.39,41.7 SW29.1 143.99,40.93 SW29.1 149.62,46.48 v1(151.65,46.48)
NET-(DC6-K): length 133.9
  Top Layer w0.254: v1(195.65,85.21) 195.65,80.93 194.38,79.66 194.38,62.13 v1(197.33,59.18) ; v1(206.98,47.75) v1(206.98,50.55)
  Bottom Layer w0.254: v1(195.65,85.21) 194.88,85.21 DI6.1 ; 205.96,40.89 207.38,39.47 207.38,38.97 211.19,35.16 220.34,35.16 SW33.1 224.95,36.17 SW33.1 ; 205.96,40.89 SW32.1 197.58,40.89 SW32.1 197.54,41.7 193.48,45.76 187,45.76 SW31.1 178.53,40.89 SW31.1 178.49,41.7 174.43,45.76 167.95,45.76 SW30.1 159.48,40.89 SW30.1 ; 205.96,40.89 205.2,41.66 205.2,45.97 v1(206.98,47.75) ; DC6.1 206.98,51.45 v1(206.98,50.55) 201.9,50.55 197.84,54.61 197.84,58.67 v1(197.33,59.18)
NET-(DC7-K): length 299.9
  Top Layer w0.254: v1(116.16,18.41) 117.43,17.14 117.94,17.14 ; v1(164.67,31.36) 139.53,31.36 125.3,17.14 117.94,17.14 ; v1(81.75,17.12) 81.67,17.12 v1(77.64,21.15) ; 117.94,17.14 SW37.1 ; v1(53.13,17.08) SW34.1 40.62,17.08 v1(38.84,15.3) ; v1(191.28,73.84) 193.82,71.3 193.82,59.11 193,58.29 193,41.89 v1(193.63,41.27)
  Bottom Layer w0.254: v1(81.75,17.12) SW36.1 90.42,17.08 SW36.1 98.89,21.95 109.37,21.95 SW37.1 115.48,18.41 v1(116.16,18.41) ; 209.75,20.13 211.53,21.91 217.33,21.91 221.35,17.88 SW39.1 224.95,17.12 SW39.1 240.36,17.08 SW40.1 244,17.12 SW40.1 ; 209.75,20.13 206.71,17.08 SW38.1 205.9,17.12 SW38.1 ; 209.75,20.13 197.44,32.45 DC7.1 196.42,31.62 192.1,31.62 191.59,32.12 ; v1(38.84,15.3) 38.84,16.28 SW34.1 ; DI7.1 190.52,84.7 190.52,79.94 193.06,77.4 193.06,75.37 191.53,73.84 v1(191.28,73.84) ; 191.59,32.12 190.83,31.36 v1(164.67,31.36) ; 191.59,32.12 191.59,33.01 193.88,35.3 193.88,38.22 193.37,38.73 193.37,41.01 v1(193.63,41.27) ; v1(53.13,17.08) 53.17,17.12 SW35.1 61.85,17.08 SW35.1 70.28,21.91 76.88,21.91 v1(77.64,21.15)
NET-(R3-PAD1): length 3.4
  Top Layer w0.254: TP1.1 v1(8.08,59.39)
  Bottom Layer w0.254: v1(8.08,59.39) 8.08,59.02 R3.1
NET-(R3-PAD2): length 227.2
  Bottom Layer w0.254: R3.2 15.88,49.72 220.09,49.72 221.11,48.7 222.89,48.7 224.16,49.97 232.67,49.97 232.93,49.72
NET-(R4-PAD1): length 3.2
  Top Layer w0.254: TP2.1 v1(8.33,40.89)
  Bottom Layer w0.254: v1(8.33,40.89) 8.33,40.35 R4.1
NET-(R4-PAD2): length 230.9
  Top Layer w0.254: v1(228.43,49.13) 228.43,49.39 v1(229.65,50.61)
  Bottom Layer w0.254: v1(228.43,49.13) 227.41,48.12 220.81,48.12 219.79,49.13 20.91,49.13 R4.2 ; U2.5 233.57,50.87 229.91,50.87 v1(229.65,50.61)
NET-(R5-PAD1): length 3.7
  Top Layer w0.254: TP3.1 v1(8.2,22.35)
  Bottom Layer w0.254: R5.1 8.2,21.56 v1(8.2,22.35)
NET-(R5-PAD2): length 246.2
  Top Layer w0.254: v1(37.16,41.64) 35.64,40.11 v1(32.59,40.11)
  Bottom Layer w0.254: R5.2 10.24,18.78 30.05,38.59 30.05,38.84 31.32,40.11 v1(32.59,40.11) ; v1(37.16,41.64) 43.01,47.48 150.96,47.48 151.97,48.5 217.76,48.5 224.11,42.15 228.43,42.15 234.98,48.7 234.98,51.26 234.72,51.51
NET-(R6-PAD1): length 3.5
  Top Layer w0.254: TP4.1 v1(258.27,56.59)
  Bottom Layer w0.254: R6.1 258.27,55.42 v1(258.27,56.59)
NET-(R6-PAD2): length 22.8
  Bottom Layer w0.254: R6.2 255.86,51.5 243.92,51.5 243.67,51.75 236.28,51.75 U2.7
NET-(R7-PAD1): length 3.5
  Top Layer w0.254: TP5.1 v1(258.39,40.89)
  Bottom Layer w0.254: v1(258.39,40.89) 258.39,39.92 R7.1
NET-(R7-PAD2): length 39.3
  Bottom Layer w0.254: R7.2 256.37,38.42 256.37,50.61 255.95,51.02 243.51,51.02 243.25,51.28 235.89,51.28 234.36,52.8 234.36,53.05 234.87,53.56 236.27,53.56 236.52,53.31
NET-(R8-PAD1): length 3.4
  Top Layer w0.254: TP6.1 v1(258.4,17.73)
  Bottom Layer w0.254: v1(258.4,17.73) 258.4,16.81 R8.1
NET-(R8-PAD2): length 41.9
  Bottom Layer w0.254: R8.2 256.11,15.56 256.11,33.72 240.58,49.25
NET-(SW101-PAD2): length 21
  Bottom Layer w0.254: SW101.2 223.98,80.76 230.66,87.44 239.22,87.44 240.87,89.09 240.87,89.34 U101.18
NET-(U1-~{RESET}): length 22
  Top Layer w0.254: v1(244.55,59.81) 244.55,61.33 240.23,65.65 v1(233.12,65.65)
  Bottom Layer w0.254: v1(244.55,59.81) 245.82,58.54 R2.2 ; U1.18 230.21,67.17 230.21,66.41 230.97,65.65 v1(233.12,65.65)
NET-(U2-C1): length 6
  Bottom Layer w0.254: 231.13,47.92 230.88,48.17 229.47,48.17 227.03,45.74 C1.2
NET-(U2-CSEL): length 12.8
  Bottom Layer w0.254: U2.3 232.24,48.61 232.24,46.88 228.17,42.81 226.39,42.81 C2.2
NET-(U2-VDD): length 26.2
  Top Layer w0.254: v1(247.35,48.58) 247.35,54.35 v1(247.6,54.6)
  Bottom Layer w0.254: v1(247.35,48.58) 246.58,47.81 C3.2 241.76,50.35 239.15,50.35 234.07,45.27 234.07,43.18 U2.16 ; v1(247.6,54.6) 247.6,54.09 R9.1
NET-(U101-A7_SCK{SLASH}1.13): length 5.8
  Top Layer w0.254: U101.9 249.38,78.36 TP10.1
NET-(U101-RESET): length 24
  Top Layer w0.254: v1(230.58,84.64) 232.36,84.64 236.29,88.57 237.3,88.57 238.2,89.47
  Bottom Layer w0.254: v1(230.58,84.64) 230.33,84.64 223.98,78.29 SW101.1
S0: length 340.9
  Top Layer w0.254: v1(206.09,66.4) 227.68,66.4 v1(228.18,65.89) ; v1(150.81,48.37) 152.33,49.89 ; 152.33,49.89 152.33,49.13 v1(153.6,47.86) ; 152.33,49.89 v1(152.84,50.4) ; v1(29.9,50.4) v1(31.94,48.37)
  Bottom Layer w0.254: D34.1 49.15,12.11 49.15,15.35 45.84,18.65 45.84,20.43 33.65,32.62 D23.1 34.73,33.95 34.73,45.06 ; 159.7,51.67 D19.1 ; 159.7,51.67 159.7,59.54 157.83,61.42 157.83,68.94 D8.1 160.62,71.73 200.75,71.73 v1(206.09,66.4) ; 159.7,51.67 159.19,51.67 157.92,50.4 v1(152.84,50.4) ; 34.73,45.06 38.03,48.37 v1(150.81,48.37) ; 34.73,45.06 31.94,47.86 v1(31.94,48.37) ; v1(29.9,50.4) 28.63,51.67 29.81,52.84 29.81,67.16 D1.1 ; U1.21 233.89,65.25 231.99,63.35 230.72,63.35 v1(228.18,65.89) ; v1(153.6,47.86) 157.41,44.05 157.41,39.22 164.02,32.62 D30.1
S1: length 293.7
  Top Layer w0.254: v1(233.27,68.94) 224.63,60.31 214.04,60.31 212.12,58.38 212.12,57.77 v1(194.08,39.73) 192.44,41.37 192.44,42.64 v1(184.69,50.4) ; v1(51.34,50.4) 57.43,44.3 v1(57.43,41.25) ; v1(124.93,70.72) v1(161,70.72)
  Bottom Layer w0.254: 197.13,36.68 197,36.68 D31.1 ; 197.13,36.68 197.44,36.38 DC7.2 ; 197.13,36.68 v1(194.08,39.73) ; U1.22 235.04,67.42 235.04,68.18 234.28,68.94 v1(233.27,68.94) ; 51.34,64.18 59.79,72.63 104.75,72.63 107.15,75.04 108.93,75.04 112.23,71.73 123.92,71.73 v1(124.93,70.72) ; 51.34,64.18 45.3,70.21 D2.1 ; 51.34,64.18 51.34,52.94 D13.1 v1(51.34,50.4) ; 167.35,70.72 166.84,70.21 166.84,58.02 173.19,51.67 D20.1 v1(184.69,50.4) ; 167.35,70.72 v1(161,70.72) ; 167.35,70.72 D9.1 ; v1(57.43,41.25) 56.16,39.98 56.16,36.05 D24.1
S2: length 276.1
  Top Layer w0.254: v1(70.39,50.4) 78.51,42.27 v1(78.51,34.91) 76.48,32.87 v1(76.48,10.52) ; v1(206.02,65.45) 226.85,65.45 v1(227.1,65.7) ; v1(190.53,67.86) 189.51,66.85 189.51,60.5 170.21,41.19 166.4,41.19 164.62,39.41 164.62,38.91 160.3,34.59 v1(160.3,33.76)
  Bottom Layer w0.254: v1(160.3,33.76) 157.76,31.22 80.04,31.22 78.51,32.75 v1(78.51,34.91) ; v1(70.39,50.4) D14.1 70.2,52.75 70.2,55.73 69.43,56.5 69.43,60.05 70.45,61.07 70.45,64.62 D3.1 ; v1(206.02,65.45) 204.75,64.18 203.74,64.18 ; D21.1 203.48,52.69 203.48,55.03 ; v1(190.53,67.86) 194.85,67.86 D10.1 203.36,65.06 203.36,64.55 203.74,64.18 ; 203.74,64.18 203.74,56.05 203.48,55.8 203.48,55.03 ; 203.48,55.03 207.08,55.03 DC6.2 ; U1.23 236.43,66.29 232.79,62.65 230.15,62.65 v1(227.1,65.7) ; v1(76.48,10.52) 76.48,9.03 D35.1
S3: length 269.8
  Top Layer w0.254: v1(98.12,20.22) 98.38,20.48 v1(98.38,22.51) v1(83.9,36.99) 83.9,47.4 v1(86.9,50.4) ; v1(237.52,61.07) 237.52,60.31 232.69,55.48 227.61,55.48 v1(221.52,49.38) 221.52,44.56 v1(209.58,32.62) 209.07,32.62 205.31,28.86 v1(190.07,28.86)
  Bottom Layer w0.254: v1(221.52,49.38) D22.1 217.32,55.87 217.32,59.17 214.91,61.58 214.91,66.5 219.13,70.72 ; U1.24 237.52,67.13 v1(237.52,61.07) ; 104.83,8.81 101.43,12.22 101.43,15.4 98.12,18.7 v1(98.12,20.22) ; v1(86.9,50.4) D15.1 89.44,52.94 89.44,64.69 D4.1 ; v1(209.58,32.62) D32.1 ; v1(98.38,22.51) 105.24,29.37 188.55,29.37 189.06,28.86 v1(190.07,28.86) ; v1(83.9,36.99) DC5.2
S4: length 260.1
  Top Layer w0.254: v1(105.95,50.4) v1(99.34,43.8) 99.34,41.51 121.44,19.41 ; v1(236.69,34.21) 236.69,40.81 235.68,41.83 235.68,54.78 238.98,58.08 v1(238.98,60.62) ; v1(107.28,65.39) 107.28,61.83 v1(109.57,59.54) ; v1(205.2,27.86) 189.96,27.86 185.7,32.11 133.63,32.11 121.44,19.92 121.44,19.41 ; 121.44,19.41 v1(121.69,19.16)
  Bottom Layer w0.254: 111.85,56.24 112.86,55.24 DC4.2 ; 111.85,56.24 109.57,58.53 v1(109.57,59.54) ; 111.85,56.24 111.79,56.24 D16.1 v1(105.95,50.4) ; D26.1 99.34,34.27 v1(99.34,43.8) ; D5.1 102.45,70.21 v1(107.28,65.39) ; v1(236.69,34.21) 236.95,33.95 236.95,29.13 235.68,27.86 ; v1(121.69,19.16) 125.25,15.6 125.25,12.2 D37.1 ; 235.68,27.86 v1(205.2,27.86) ; 235.68,27.86 D33.1 ; v1(238.98,60.62) 238.98,67.29 U1.25
S5: length 232.8
  Top Layer w0.254: v1(239.68,62.4) 238.15,60.88 238.15,58.84 230.53,51.22 230.53,49.95 v1(204.62,24.05) ; v1(116.68,62.08) 117.69,61.07 117.69,59.18 116.74,58.23 v1(116.74,34.97)
  Bottom Layer w0.254: 116.74,32.68 118.52,34.46 160.57,34.46 164.38,30.65 189.39,30.65 199.55,20.49 ; 116.74,32.68 v1(116.74,34.97) ; 116.74,32.68 D27.1 ; D38.1 206.91,8.81 200.31,15.41 200.31,19.73 199.55,20.49 ; 116.68,71.23 v1(116.68,62.08) ; 116.68,71.23 117.19,71.23 117.69,70.72 D6.1 ; 116.68,71.23 110.88,71.23 DC3.2 ; 199.55,20.49 201.07,20.49 v1(204.62,24.05) ; v1(239.68,62.4) 239.68,66.75 U1.26
S6: length 242.7
  Top Layer w0.254: v1(135.79,33.76) 135.66,33.89 135.66,36.68 ; 240.31,64.37 v1(240.57,64.37) ; 240.31,64.37 242.09,62.59 242.09,39.98 238.53,36.43 238.53,19.16 v1(235.8,16.43) ; 240.31,64.37 239.04,64.37 235.74,61.07 231.42,61.07 219.99,49.64 219.99,46.34 206.28,32.62 139.73,32.62 135.66,36.68 ; 135.66,36.68 135.66,43.03 v1(127.28,51.42)
  Bottom Layer w0.254: v1(127.28,51.42) 127.03,51.67 D17.1 127.35,52.75 127.35,55.73 126.58,56.5 126.58,59.8 129.38,62.59 132.43,62.59 D7.1 142.9,70.72 DC2.2 ; v1(135.79,33.76) D28.1 ; v1(240.57,64.37) 241.51,65.31 U1.27 ; v1(235.8,16.43) 236.82,15.41 236.82,9.82 D39.1
S7: length 228
  Top Layer w0.254: v1(184.69,65.13) 179.86,60.31 175.94,60.31 174.02,58.38 174.02,58.02 158.27,42.27 154.71,42.27 ; v1(133.89,65.13) 140.74,58.27 140.74,56.24 v1(146.59,50.4) 154.71,42.27 ; 154.71,42.27 v1(154.71,33.64) ; v1(200.18,67.16) 230.41,67.16 233.09,69.85 v1(233.34,69.85)
  Bottom Layer w0.254: v1(184.69,65.13) 198.15,65.13 v1(200.18,67.16) ; v1(154.71,33.64) 154.71,32.75 D29.1 ; D40.1 259.17,13.12 259.17,56.64 258.41,57.4 258.02,57.4 250.65,64.77 250.65,65.78 249.89,66.54 248.87,66.54 248.11,65.78 244.3,65.78 U1.28 242.74,67.34 242.74,68.07 240.96,69.85 v1(233.34,69.85) ; D18.1 v1(146.59,50.4) ; v1(133.89,65.13) 133.89,66.38 DC1.2
S8: length 45.8
  Top Layer w0.254: v1(237.7,30.33) 235.42,32.61 235.42,41.25 v1(234.91,41.76) ; v1(236.94,50.39) 236.94,53.25 240.94,57.25 v1(240.94,59.28)
  Bottom Layer w0.254: 235.19,43.86 235.42,43.63 235.42,42.26 v1(234.91,41.76) 234.4,41.76 233.13,43.03 233.13,45.06 236.94,48.87 v1(236.94,50.39) ; U1.1 242.78,58.46 241.7,59.54 241.19,59.54 v1(240.94,59.28) ; v1(237.7,30.33) 241.01,27.02 R10.1
S9: length 35.3
  Top Layer w0.254: v1(237.45,34.57) 237.45,40.92 236.18,42.19 236.18,43.46 v1(236.43,43.71) 237.45,43.71 241.51,47.78 241.51,55.91 v1(241.26,56.16)
  Bottom Layer w0.254: v1(241.26,56.16) 241.26,57.57 U1.2 ; U2.14 236.43,44.41 v1(236.43,43.71) ; R11.1 237.45,32.28 v1(237.45,34.57)
S10: length 41.8
  Top Layer w0.254: v1(239.23,35.51) 242.78,39.07 v1(242.78,52.53)
  Bottom Layer w0.254: R12.1 241.01,31.95 238.21,34.75 ; 238.21,34.75 237.2,35.76 237.2,45.45 236.99,45.65 ; 238.21,34.75 238.47,34.75 v1(239.23,35.51) ; v1(242.78,52.53) 240.24,55.08 U1.3
S11: length 25.5
  Top Layer w0.254: v1(237.63,47.57) 238.4,47.57 238.97,48.14 v1(238.97,52.45)
  Bottom Layer w0.254: R13.1 238.14,37.54 238.14,46.3 U2.12 237.89,47.31 v1(237.63,47.57) ; v1(238.97,52.45) U1.4
S12: length 21.5
  Top Layer w0.254: v1(237.77,53.04) 238.28,52.53 v1(238.28,48.47)
  Bottom Layer w0.254: U1.5 237.77,57.74 v1(237.77,53.04) ; v1(238.28,48.47) 238.79,47.96 238.79,47.45 239.04,47.2 239.04,39.61 R14.1
S13: length 22.8
  Top Layer w0.254: v1(236.43,54.59) 236.18,54.34 236.18,47.99 237.45,46.72 239.48,46.72 v1(239.99,47.22)
  Bottom Layer w0.254: R15.1 241.01,45.95 239.99,46.97 239.99,48.04 U2.10 ; v1(236.43,54.59) 236.43,57.81 U1.6
S14: length 241.4
  Top Layer w0.254: v1(189.19,29.72) 204.18,29.72 220.69,46.23 220.69,49.53 227.55,56.39 232.12,56.39 v1(232.37,56.13)
  Bottom Layer w0.254: v1(189.19,29.72) 188.94,29.97 93.69,29.97 80.99,17.27 80.99,15.24 76.93,11.18 75.66,11.18 72.35,7.87 51.53,7.87 47.21,12.19 31.71,12.19 26.63,7.11 26.63,4.32 27.14,3.81 J403.3 ; U1.7 235.16,57.06 234.23,56.13 v1(232.37,56.13)
SCK: length 91.5
  Top Layer w0.254: v1(228.84,72.26) 228.84,78.36 231.38,80.9 ; J1.1 199.06,20.7 222.71,44.36 v1(222.71,49.44)
  Bottom Layer w0.254: v1(228.84,72.26) 225.53,68.96 225.53,66.17 228.81,62.9 U1.12 228.81,55.53 v1(222.71,49.44)
SCL: length 47
  Top Layer w0.254: U101.21 243.15,74.1 243.15,73.85 248.51,68.49 248.51,66.21 248,65.7 248,56.05 248.51,55.54 248.51,29.92
SDA: length 44.6
  Top Layer w0.254: v1(245.95,66.61) 245.95,29.94 245.97,29.92
  Bottom Layer w0.254: v1(245.95,66.61) 245.95,73.47 U101.22
X: length 246.9
  Top Layer w0.254: v1(43.26,21.97) 59.01,37.72 59.01,40 70.19,51.18 103.61,51.18 118.35,65.91 170.67,65.91 193.78,89.03 230.87,89.03 231.38,88.52
  Bottom Layer w0.254: J403.4 26.89,3.31 26.13,4.07 26.13,8.9 39.2,21.97 v1(43.26,21.97)
Y: length 243.7
  Top Layer w0.254: v1(27.91,6.59) 27.91,7.6 54.97,34.67 54.97,37.72 68.94,51.69 78.98,51.69 83.55,56.26 83.55,57.53 106.66,80.64 v1(106.66,81.15)
  Bottom Layer w0.254: 231.38,91.06 177.78,91.06 171.94,85.22 110.73,85.22 v1(106.66,81.15) ; v1(27.91,6.59) J403.1

## Copper pours and planes (outline as drawn; the poured copper is in the pictures)
GND on Top Layer: -4.62,96.33 9.73,96.33 9.73,-4.64 -4.62,-4.64
GND on Top Layer: 256.93,97.35 271.29,97.35 271.29,-3.62 256.93,-3.62
GND on Top Layer: 9.47,99 257.12,99 257.12,-6.79 9.47,-6.79
GND on Bottom Layer: -3.73,94.36 269.06,94.36 269.06,-6.6 -3.73,-6.6
NET-(R3-PAD1) on Top Layer: 1.98,69.8 8.21,69.8 8.21,47.07 1.98,47.07
NET-(R4-PAD1) on Top Layer: 1.98,45.73 8.21,45.73 8.21,33.29 1.98,33.29
NET-(R5-PAD1) on Top Layer: 1.98,31.95 8.21,31.95 8.21,9.22 1.98,9.22
NET-(R6-PAD1) on Top Layer: 258.78,69.8 265,69.8 265,47.07 258.78,47.07
NET-(R7-PAD1) on Top Layer: 258.78,45.73 265,45.73 265,33.29 258.78,33.29
NET-(R8-PAD1) on Top Layer: 258.78,31.95 265,31.95 265,9.22 258.78,9.22

## Text on the board
Top Silkscreen Layer: 20250403 by te9no
